# EAGLE design High-Level PCB v3.0 (EAGLE 8.7.0)
TITLE: High-Level PCB
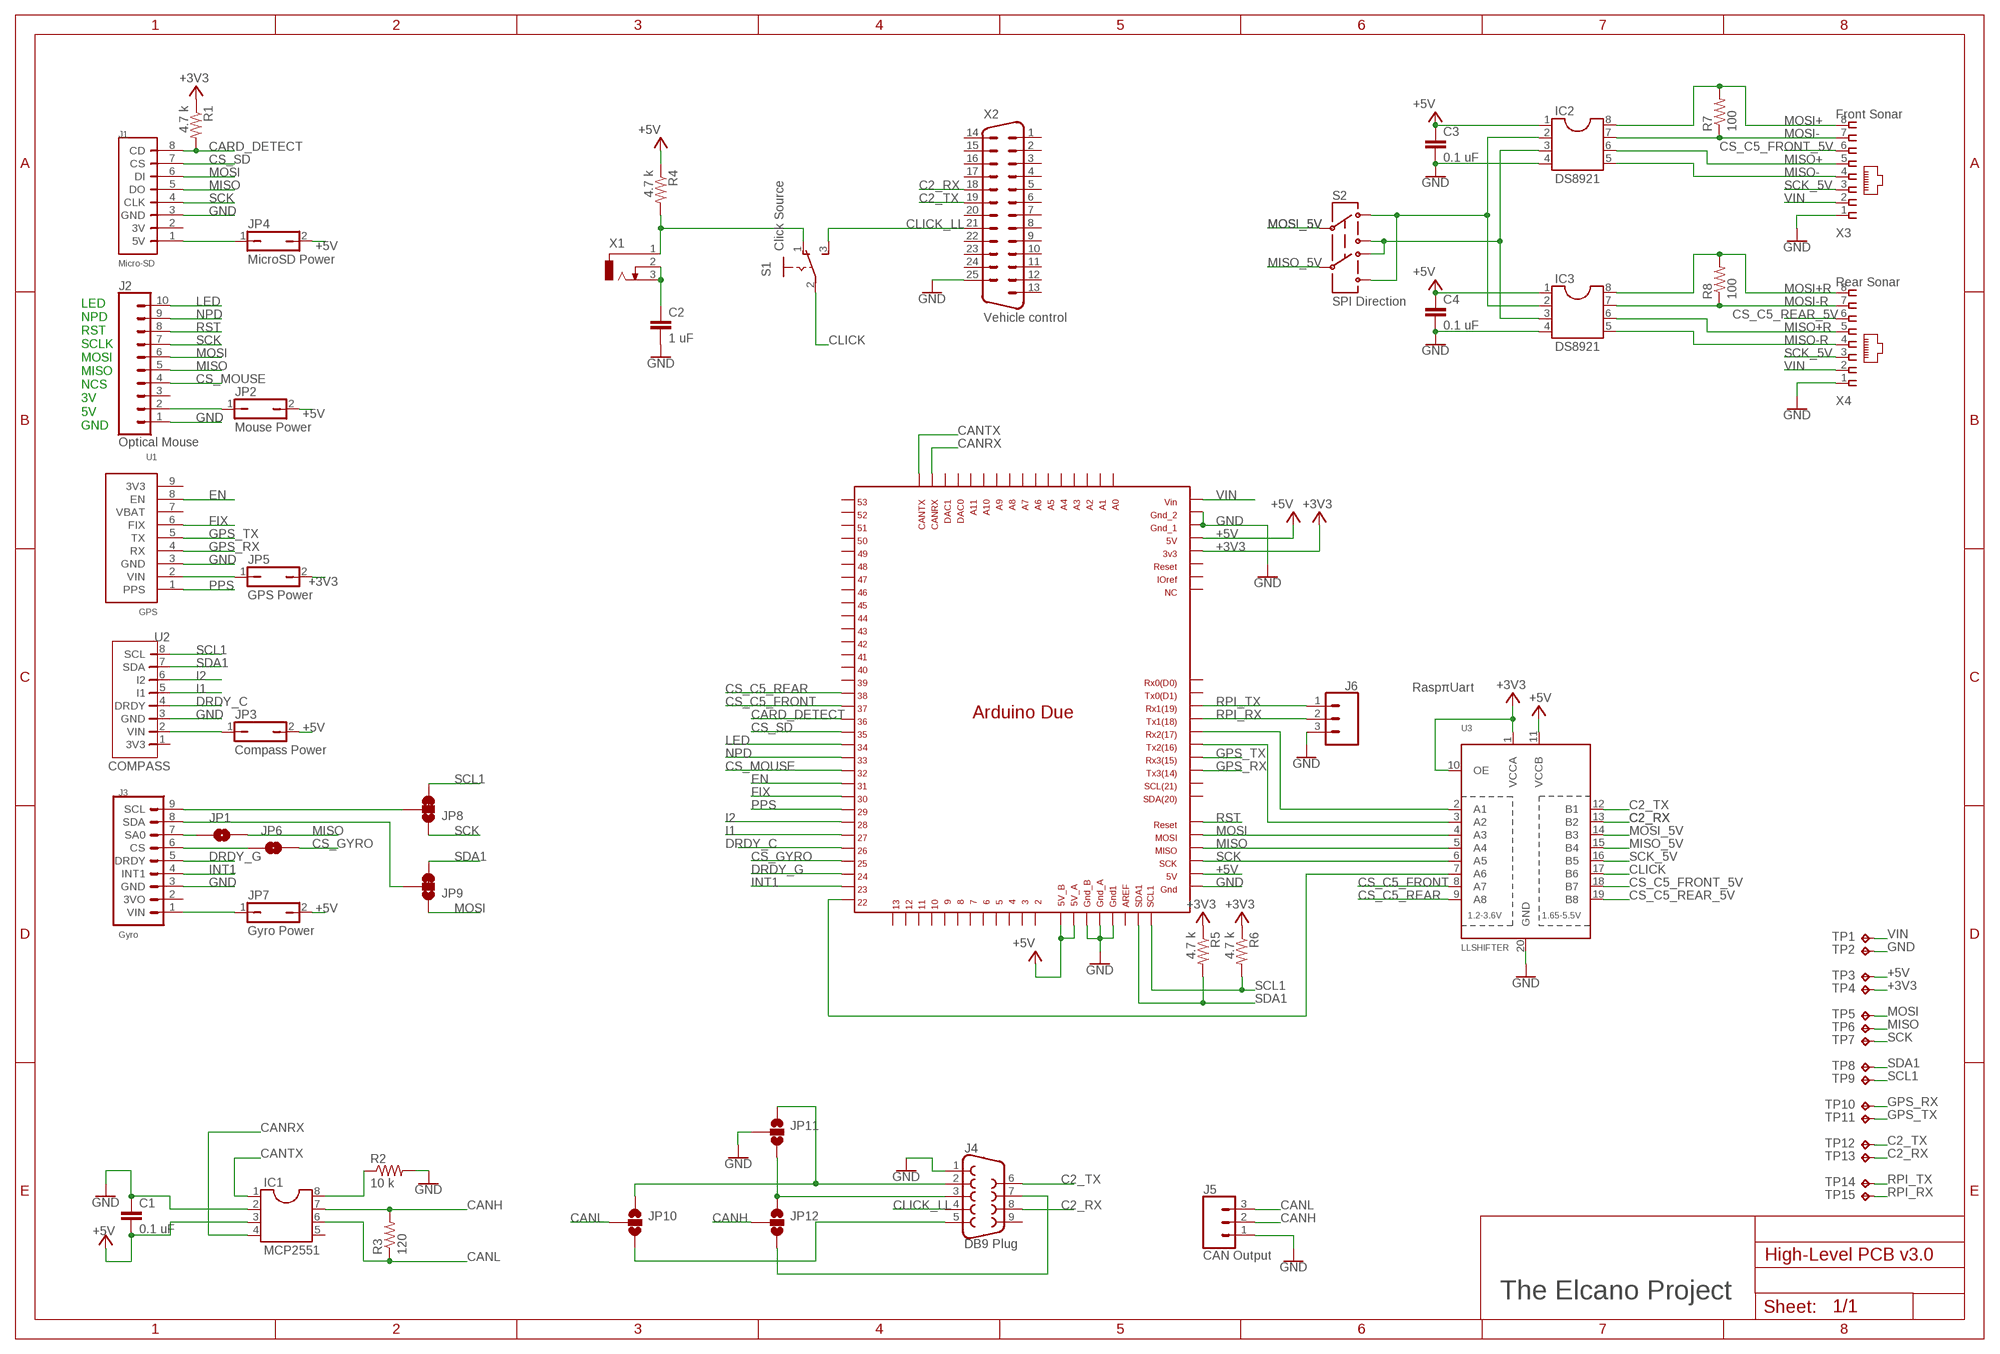
[diagram p0: schematic, sheet 1]

## Parts
C1  0.1 uF  C2.5/5  [C2.5-5]
C2  1 uF  C2.5/5  [C2.5-5]
C3  0.1 uF  C2.5/5  [C2.5-5]
C4  0.1 uF  C2.5/5  [C2.5-5]
IC1  MCP2551  DIL8  [DIL08]
IC2  DS8921  DIL8  [DIL08]
IC3  DS8921  DIL8  [DIL08]
J1  Micro-SD  MINI_SD  [ELSDCARD]
J2  Optical Mouse  CONN_10"  [1X10]
J3  Gyro  ELGYRO_L3GD20H  [ELGYRO]
J4  DB9 Plug  DB9MALE  [DB9_MALE]
J5  CAN Output  CONN_03-SCREW-5MM  [SCREWTERMINAL-5MM-3]
J6  RaspπUart  TXRX_2RSPPI  [1X03]
JP1  JUMPER-SMT_2_NO_SILK  [SMT-JUMPER_2_NO_SILK]
JP2  Mouse Power  JP1Q  [JP1]
JP3  Compass Power  JP1Q  [JP1]
JP4  MicroSD Power  JP1Q  [JP1]
JP5  GPS Power  JP1Q  [JP1]
JP6  JUMPER-SMT_2_NO_SILK  [SMT-JUMPER_2_NO_SILK]
JP7  Gyro Power  JP1Q  [JP1]
JP8  JUMPER-SMT_3_1-NC_TRACE_SILK  [SMT-JUMPER_3_1-NC_TRACE_SILK]
JP9  JUMPER-SMT_3_1-NC_TRACE_SILK  [SMT-JUMPER_3_1-NC_TRACE_SILK]
JP10  JUMPER-SMT_3_NO_SILK  [SMT-JUMPER_3_NO_SILK]
JP11  JUMPER-SMT_3_NO_SILK  [SMT-JUMPER_3_NO_SILK]
JP12  JUMPER-SMT_3_NO_SILK  [SMT-JUMPER_3_NO_SILK]
MCU1  DUE(NORMAL)  [DUE(NORMAL)]
R1  4.7 k  R-US_0204/7  [0204/7]
R2  10 k  R-US_0204/7  [0204/7]
R3  120  R-US_0204/7  [0204/7]
R4  4.7 k  R-US_0204/7  [0204/7]
R5  4.7 k  R-US_0204/7  [0204/7]
R6  4.7 k  R-US_0204/7  [0204/7]
R7  100  R-US_0204/7  [0204/7]
R8  100  R-US_0204/7  [0204/7]
S1  Click Source  ELSWITCHSP  [SP_ELSWITCH]
S2  SPI Direction  DPDT  [DPDT]
TP1  TPPAD1-17  [P1-17]
TP2  TPPAD1-17  [P1-17]
TP3  TPPAD1-17  [P1-17]
TP4  TPPAD1-17  [P1-17]
TP5  TPPAD1-17  [P1-17]
TP6  TPPAD1-17  [P1-17]
TP7  TPPAD1-17  [P1-17]
TP8  TPPAD1-17  [P1-17]
TP9  TPPAD1-17  [P1-17]
TP10  TPPAD1-17  [P1-17]
TP11  TPPAD1-17  [P1-17]
TP12  TPPAD1-17  [P1-17]
TP13  TPPAD1-17  [P1-17]
TP14  TPPAD1-17  [P1-17]
TP15  TPPAD1-17  [P1-17]
U1  GPS  ELGPS  [ELGPS]
U2  COMPASS  ELCOMPASS  [ELCOMPASS]
U3  LLSHIFTER  ELSHIFTER  [ELSHIFTER]
X1  2.5MMJACK  [2.5MMJACK]
X2  Vehicle control  M25H  [M25H]
X3  Front Sonar  RJ45-8L-B  [RJ45-NO-SHIELD]
X4  Rear Sonar  RJ45-8L-B  [RJ45-NO-SHIELD]

## Nets
+3V3 [Power]: JP5.2 MCU1.3V3 R1.1 R5.1 R6.1 TP4.TP U3.1(VCCA) U3.10(OE)
+5V [Power]: C1.2 C3.1 C4.1 IC1.3 IC2.1 IC3.1 JP2.2 JP3.2 JP4.2 JP7.2 MCU1.5V MCU1.5V_A MCU1.5V_B MCU1.GND_ICSP R4.1 TP3.TP U3.11(VCCB)
C2_RX: J4.8 TP13.TP U3.13(B2) X2.18
C2_TX: J4.6 TP12.TP U3.12(B1) X2.19
CANH: IC1.7 J5.2 JP12.2 R3.2
CANL: IC1.6 J5.3 JP10.2 R3.1
CANRX: IC1.4 MCU1.CANRX
CANTX: IC1.1 MCU1.CANTX
CARD_DETECT: J1.8(CD) MCU1.36 R1.2
CLICK: S1.2(P) U3.17(B6)
CLICK_LL: J4.4 S1.3(S) X2.21
CS_C5_FRONT: MCU1.37 U3.8(A7)
CS_C5_FRONT_5V: U3.18(B7) X3.6
CS_C5_REAR: MCU1.38 U3.9(A8)
CS_C5_REAR_5V: U3.19(B8) X4.6
CS_GYRO: JP6.2 MCU1.25
CS_MOUSE: J2.4 MCU1.32
CS_SD: J1.7(CS) MCU1.35
DRDY_C: MCU1.26 U2.4(DRDY)
DRDY_G: J3.5(DRDY) MCU1.24
EN: MCU1.31 U1.8(EN)
FIX: MCU1.30 U1.6(FIX)
GND: C1.1 C2.2 C3.2 C4.2 IC1.2 IC2.4 IC3.4 J1.3(GND) J2.1 J3.3(GND) J4.1 J5.1 J6.3 JP11.2 MCU1.5V_ICSP MCU1.GND1 MCU1.GND_1 MCU1.GND_2 MCU1.GND_A MCU1.GND_B R2.2 TP2.TP U1.3(GND) U2.3(GND) U3.20(GND) X2.25 X3.1 X4.1
GPS_RX: MCU1.TX3 TP10.TP U1.4(RX)
GPS_TX: MCU1.RX3 TP11.TP U1.5(TX)
I1: MCU1.27 U2.5(I1)
I2: MCU1.28 U2.6(I2)
INT1: J3.4(INT1) MCU1.23
LED: J2.10 MCU1.34
MISO: J1.5(DO) J2.5 JP1.2 MCU1.MISO_ICSP TP6.TP U3.5(A4)
MISO+: IC2.6 X3.5
MISO+R: IC3.6 X4.5
MISO-: IC2.5 X3.4
MISO-R: IC3.5 X4.4
MISO_5V: S2.5 U3.15(B4)
MOSI: J1.6(DI) J2.6 JP9.1 MCU1.MOSI_ICSP TP5.TP U3.4(A3)
MOSI+: IC2.8 R7.2 X3.8
MOSI+R: IC3.8 R8.2 X4.8
MOSI-: IC2.7 R7.1 X3.7
MOSI-R: IC3.7 R8.1 X4.7
MOSI_5V: S2.2 U3.14(B3)
N$1: C2.1 X1.2 X1.3
N$2: IC2.2 IC3.2 S2.1 S2.6
N$3: IC2.3 IC3.3 S2.3 S2.4
N$4: MCU1.TX2 U3.3(A2)
N$5: MCU1.RX2 U3.2(A1)
N$7: R4.2 S1.1(O) X1.1
N$8 [Power]: JP3.1 U2.2(VIN)
N$9 [Power]: J3.1(VIN) JP7.1
N$10 [Power]: J1.1(5V) JP4.1
N$11: J4.3 JP11.3 JP12.1
N$12: MCU1.22 U3.7(A6)
N$13 [Power]: J2.2 JP2.1
N$14 [Power]: JP5.1 U1.2(VIN)
N$15: J4.5 JP10.3
N$16: J4.7 JP12.3
N$17: IC1.8 R2.1
N$18: J4.2 JP10.1 JP11.1
N$19: J3.6(CS) JP6.1
N$20: J3.7(SA0) JP1.1
N$21: J3.8(SDA) JP9.2
N$22: J3.9(SCL) JP8.2
NPD: J2.9 MCU1.33
PPS: MCU1.29 U1.1(PPS)
RPI_RX: J6.2 MCU1.TX1 TP15.TP
RPI_TX: J6.1 MCU1.RX1 TP14.TP
RST: J2.8 MCU1.RESET_ICSP
SCK: J1.4(CLK) J2.7 JP8.1 MCU1.SCK_ICSP TP7.TP U3.6(A5)
SCK_5V: U3.16(B5) X3.3 X4.3
SCL1: JP8.3 MCU1.SCL1 R6.2 TP9.TP U2.8(SCL)
SDA1: JP9.3 MCU1.SDA1 R5.2 TP8.TP U2.7(SDA)
VIN [Power]: MCU1.VIN TP1.TP X3.2 X4.2
Unconnected: IC1.5 J1.2(3V) J2.3 J3.2(3VO) J4.9 MCU1.2 MCU1.3 MCU1.4 MCU1.5 MCU1.6 MCU1.7 MCU1.8 MCU1.9 MCU1.10 MCU1.11 MCU1.12 MCU1.13 MCU1.39 MCU1.40 MCU1.41 MCU1.42 MCU1.43 MCU1.44 MCU1.45 MCU1.46 MCU1.47 MCU1.48 MCU1.49 MCU1.50 MCU1.51 MCU1.52 MCU1.53 MCU1.A0 MCU1.A1 MCU1.A2 MCU1.A3 MCU1.A4 MCU1.A5 MCU1.A6 MCU1.A7 MCU1.A8 MCU1.A9 MCU1.A10 MCU1.A11 MCU1.AREF MCU1.DAC0 MCU1.DAC1 MCU1.IOREF MCU1.NC MCU1.RESET MCU1.RX0 MCU1.SCL MCU1.SDA MCU1.TX0 U1.7(VBAT) U1.9(3V3) U2.1(3V3) X2.1 X2.2 X2.3 X2.4 X2.5 X2.6 X2.7 X2.8 X2.9 X2.10 X2.11 X2.12 X2.13 X2.14 X2.15 X2.16 X2.17 X2.20 X2.22 X2.23 X2.24

## Notes on the sheet
- LED
  NPD
  RST
  SCLK
  MOSI
  MISO
  NCS
  3V
  5V
  GND
- The Elcano Project

## Library data of the parts
C1-C4 = capacitor-wima:C: CAPACITOR naming: grid - package width
IC1-IC3 = ic-package:DIL8: Dual In Line / Socket
J1 = ELCano_Footprints:MINI_SD: SD Breakoutboard footprint for ELCano Project https://learn.adafruit.com/adafruit-micro-sd-breakout-board-card-tutorial/introduction
J2 = SparkFun-Connectors:CONN_10: Multi connection point. Often used as Generic Header-pin footprint for 0.1 inch spaced/style header connections On any of the 0.1 inch spaced packages, you can populate with these: Break Away Headers - Straight <https://www.sparkfun.com/products/116> (PRT-00116) Break Away Male Headers - Right Angle <https://www.sparkfun.com/products/553> (PRT-00553) Female Headers <https://www.sparkfun.com/products/115> (PRT-00115) Break Away Headers - Machine Pin <https://www.sparkfun.com/products/117> (PRT-00117) Break Away Female Headers - Swiss Machine Pin <https://www.sparkfun.com/products/743> (PRT-00743) Arduino Stackable Header - 10 Pin <https://www.sparkfun.com/products/11376> (PRT-11376) For SCREWTERMINALS and SPRING TERMINALS visit here: Screw Terimnals on SparkFun.com <https://www.sparkfun.com/search/results?term=Screw+Terminals> (5mm/3.5mm/2.54mm spacing) This device is also useful as a general connection point to wire up your design to another part of your project. Our various solder wires solder well into these plated through hole pads. Hook-Up Wire - Assortment (Stranded, 22 AWG) <https://www.sparkfun.com/products/11375> (PRT-11375) Hook-Up Wire - Assortment (Solid Core, 22 AWG) <https://www.sparkfun.com/products/11367> (PRT-11367) View the entire wire category on our website here <https://www.sparkfun.com/categories/141> Special notes: Molex polarized connector foot print use with SKU : PRT-08231 with associated crimp pins and housings. 1MM SMD Version SKU: PRT-10208 NOTES ON THE VARIANTS LOCK and LOCK_LONGPADS... This footprint was designed to help hold the alignment of a through-hole component (i.e. 6-pin header) while soldering it into place. You may notice that each hole has been shifted either up or down by 0.005 of an inch from it's more standard position (which is a perfectly straight line). This slight alteration caused the pins (the squares in the middle) to touch the edges of the holes. Because they are alternating, it causes a "brace" to hold the component in place. 0.005 has proven to be the perfect amount of "off-center" position when using our standard breakaway headers. Although looks a little odd when you look at the bare footprint, once you have a header in there, the alteration is very hard to notice. Also,if you push a header all the way into place, it is covered up entirely on the bottom side.; PROD_ID: CONN-11563
J3 = ELCano_Footprints:ELGYRO_L3GD20H
J4 = SparkFun-Connectors:DB9: DB9 Connector Standard DB9 (D-Sub 9) serial connector. Can be used for CAN bus as well as RS485 and RS232. Footprint production proven. Here is the female version connector we sell at SparkFun: 9 Pin Female Serial Connector - PCB Mount <https://www.sparkfun.com/products/429> (PRT-00429) This connector has been used on the following SparkFun products: SparkFun RS232 Shifter - SMD <https://www.sparkfun.com/products/449> (PRT-00449) SparkFun RS232 Shifter SMD (No DB9) <https://www.sparkfun.com/products/8780> (PRT-08780); PROD_ID: CONN-09904; SPICEPREFIX: X
J5 = SparkFun-Connectors:CONN_03: Multi connection point. Often used as Generic Header-pin footprint for 0.1 inch spaced/style header connections On any of the 0.1 inch spaced packages, you can populate with these: Break Away Headers - Straight <https://www.sparkfun.com/products/116> (PRT-00116) Break Away Male Headers - Right Angle <https://www.sparkfun.com/products/553> (PRT-00553) Female Headers <https://www.sparkfun.com/products/115> (PRT-00115) Break Away Headers - Machine Pin <https://www.sparkfun.com/products/117> (PRT-00117) Break Away Female Headers - Swiss Machine Pin <https://www.sparkfun.com/products/743> (PRT-00743) Stackable Header - 3 Pin (Female, 0.1") <https://www.sparkfun.com/products/13875> (PRT-13875) For SCREWTERMINALS and SPRING TERMINALS visit here: Screw Terimnals on SparkFun.com <https://www.sparkfun.com/search/results?term=Screw+Terminals> (5mm/3.5mm/2.54mm spacing) This device is also useful as a general connection point to wire up your design to another part of your project. Our various solder wires solder well into these plated through hole pads. Hook-Up Wire - Assortment (Stranded, 22 AWG) <https://www.sparkfun.com/products/11375> (PRT-11375) Hook-Up Wire - Assortment (Solid Core, 22 AWG) <https://www.sparkfun.com/products/11367> (PRT-11367) View the entire wire category on our website here <https://www.sparkfun.com/categories/141> Special notes: Molex polarized connector foot print use with SKU : PRT-08232 with associated crimp pins and housings.; PROD_ID: CONN-10134; SF_SKU: PRT-08433
J6 = ELCano_Footprints:TXRX_2RSPPI: Multi connection point. Often used as Generic Header-pin footprint for 0.1 inch spaced/style header connections On any of the 0.1 inch spaced packages, you can populate with these: Break Away Headers - Straight <https://www.sparkfun.com/products/116> (PRT-00116) Break Away Male Headers - Right Angle <https://www.sparkfun.com/products/553> (PRT-00553) Female Headers <https://www.sparkfun.com/products/115> (PRT-00115) Break Away Headers - Machine Pin <https://www.sparkfun.com/products/117> (PRT-00117) Break Away Female Headers - Swiss Machine Pin <https://www.sparkfun.com/products/743> (PRT-00743) For SCREWTERMINALS and SPRING TERMINALS visit here: Screw Terimnals on SparkFun.com <https://www.sparkfun.com/search/results?term=Screw+Terminals> (5mm/3.5mm/2.54mm spacing) This device is also useful as a general connection point to wire up your design to another part of your project. Our various solder wires solder well into these plated through hole pads. Hook-Up Wire - Assortment (Stranded, 22 AWG) <https://www.sparkfun.com/products/11375> (PRT-11375) Hook-Up Wire - Assortment (Solid Core, 22 AWG) <https://www.sparkfun.com/products/11367> (PRT-11367) View the entire wire category on our website here <https://www.sparkfun.com/categories/141> Special notes: Molex polarized connector foot print use with: PRT-08233 with associated crimp pins and housings. 2.54_SCREWTERM for use with PRT-10571. 3.5mm Screw Terminal footprints for PRT-08084 5mm Screw Terminal footprints for use with PRT-08432
JP1 JP6 = SparkFun-Jumpers:JUMPER-SMT_2_NO: Normally open jumper This jumper has two pads in close proximity to each other. Apply solder to close the connection. Round pads are easier to solder for beginners, but are a lot larger. SparkFun Product that uses the round pads: SparkFun EL Sequencer <https://www.sparkfun.com/products/12781>
JP2-JP5 JP7 = jumper:JP1Q: JUMPER
JP8 JP9 = SparkFun-Jumpers:JUMPER-SMT_3_1-NC_TRACE: Normally closed trace jumper (1 of 2 connections) This jumper has a trace between two pads so it's normally closed (NC). The other connection is normally open (NO). Use a razor knife to open the connection. For best results follow the IPC guidelines for cutting traces: Cutout at least 0.063 mm (0.005 in). Remove all loose material to clean up the cut area. Seal the cut with an approved epoxy. Reapply solder to reclose the connection, or to close the NO connection.
JP10-JP12 = SparkFun-Jumpers:JUMPER-SMT_3_NO: Normally open jumper This jumper has three pads in close proximity to each other. Apply solder to close the connection(s).
MCU1 = DUElib130425:DUE(NORMAL)
R1 R4-R6 = resistor:R-US_: RESISTOR, American symbol
R2 R3 R7 R8 = rcl:R-US_: RESISTOR, American symbol; SPICEPREFIX: R
S1 = ELCano_Footprints:ELSWITCHSP: SLIDING SWITCH Distributor Buerklin, 11G810
S2 = ELCano_Footprints:DPDT
TP1-TP15 = testpad:TP: Test pad
U1 = ELCano_Footprints:ELGPS: FootPrint for Adafruit Ultimate GPS.
U2 = ELCano_Footprints:ELCOMPASS: ADAFRUIT LSM303DLHC COMPASS FOOT PRINT
U3 = ELCano_Footprints:ELSHIFTER: TXB0108 LEVEL SHIFTER. Foot Print for adafruit breakout board.
X1 = ELCano_Footprints:2.5MMJACK: New jack for Elcano
X2 = con-subd:M25: SUB-D; OC_FARNELL: unknown; OC_NEWARK: unknown
X3 X4 = con-tycoelectronics:RJ45: CORCOM Modular RJ Jacks No Shield Source: www.tycoelectronics.com .. ENG_DS_1654001_1099_RJ_L_0507.pdf; MF: TYCO ELECTRONICS; MPN: RJ45-8L-B; OC_FARNELL: 1279843; OC_NEWARK: 52K4445

## Net classes
1 Power: width 0.254 mm, drill 0.305 mm, clearance 0.254 mm

## Board
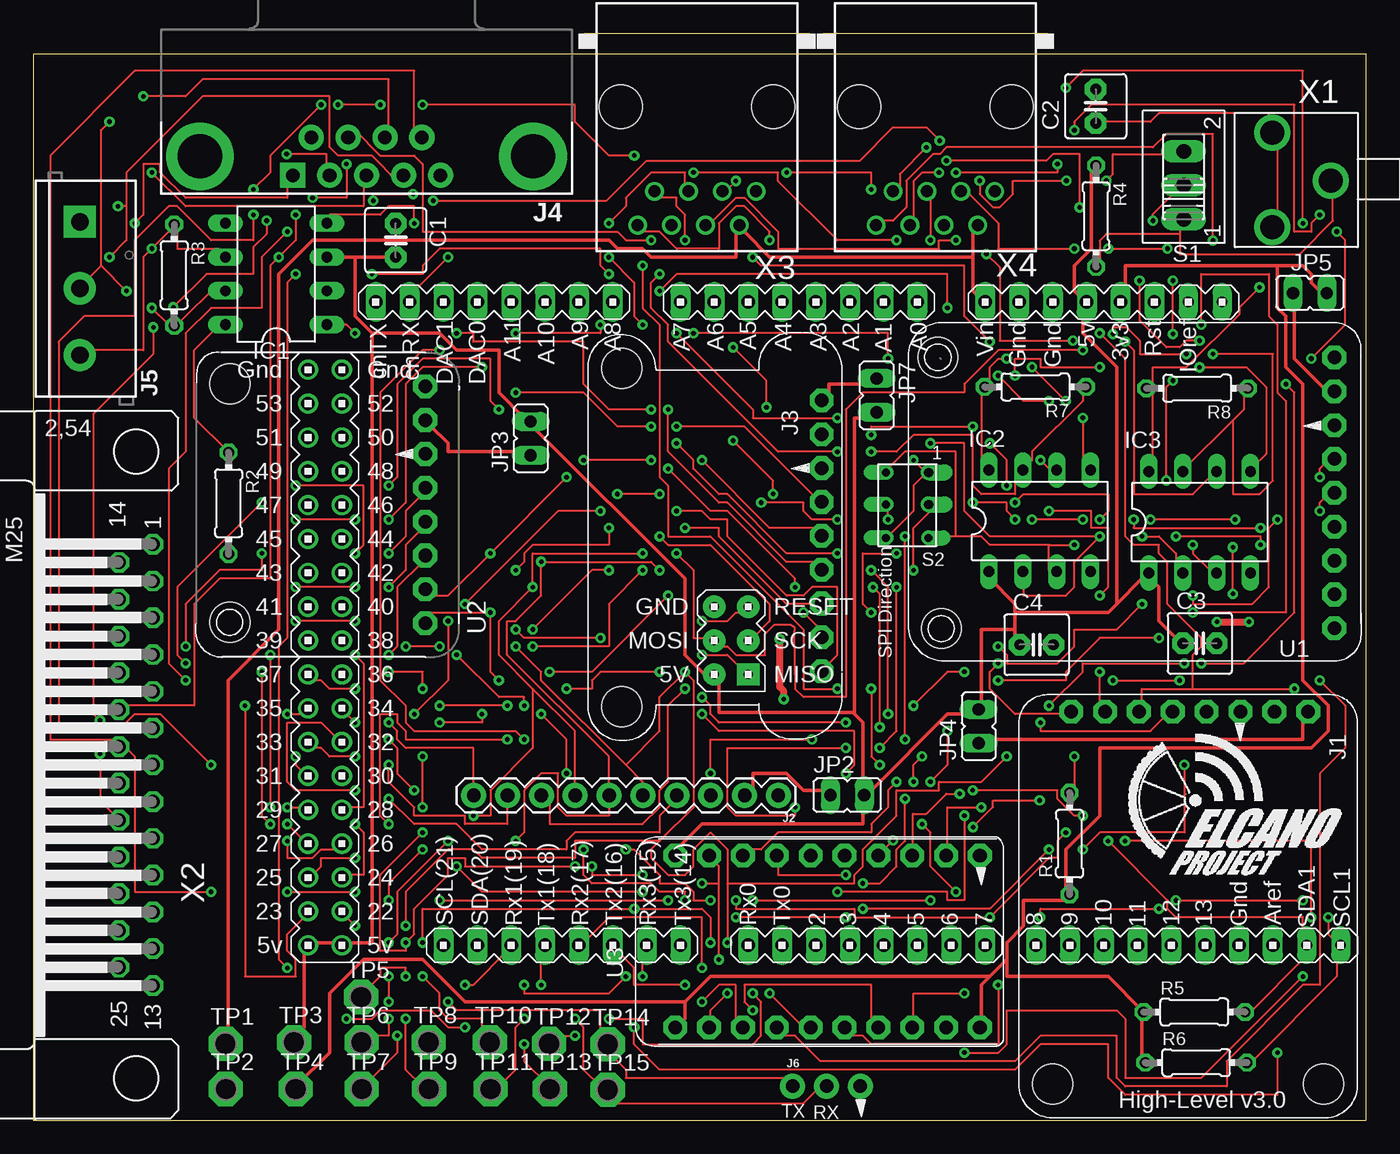
[diagram p1: board, top side]
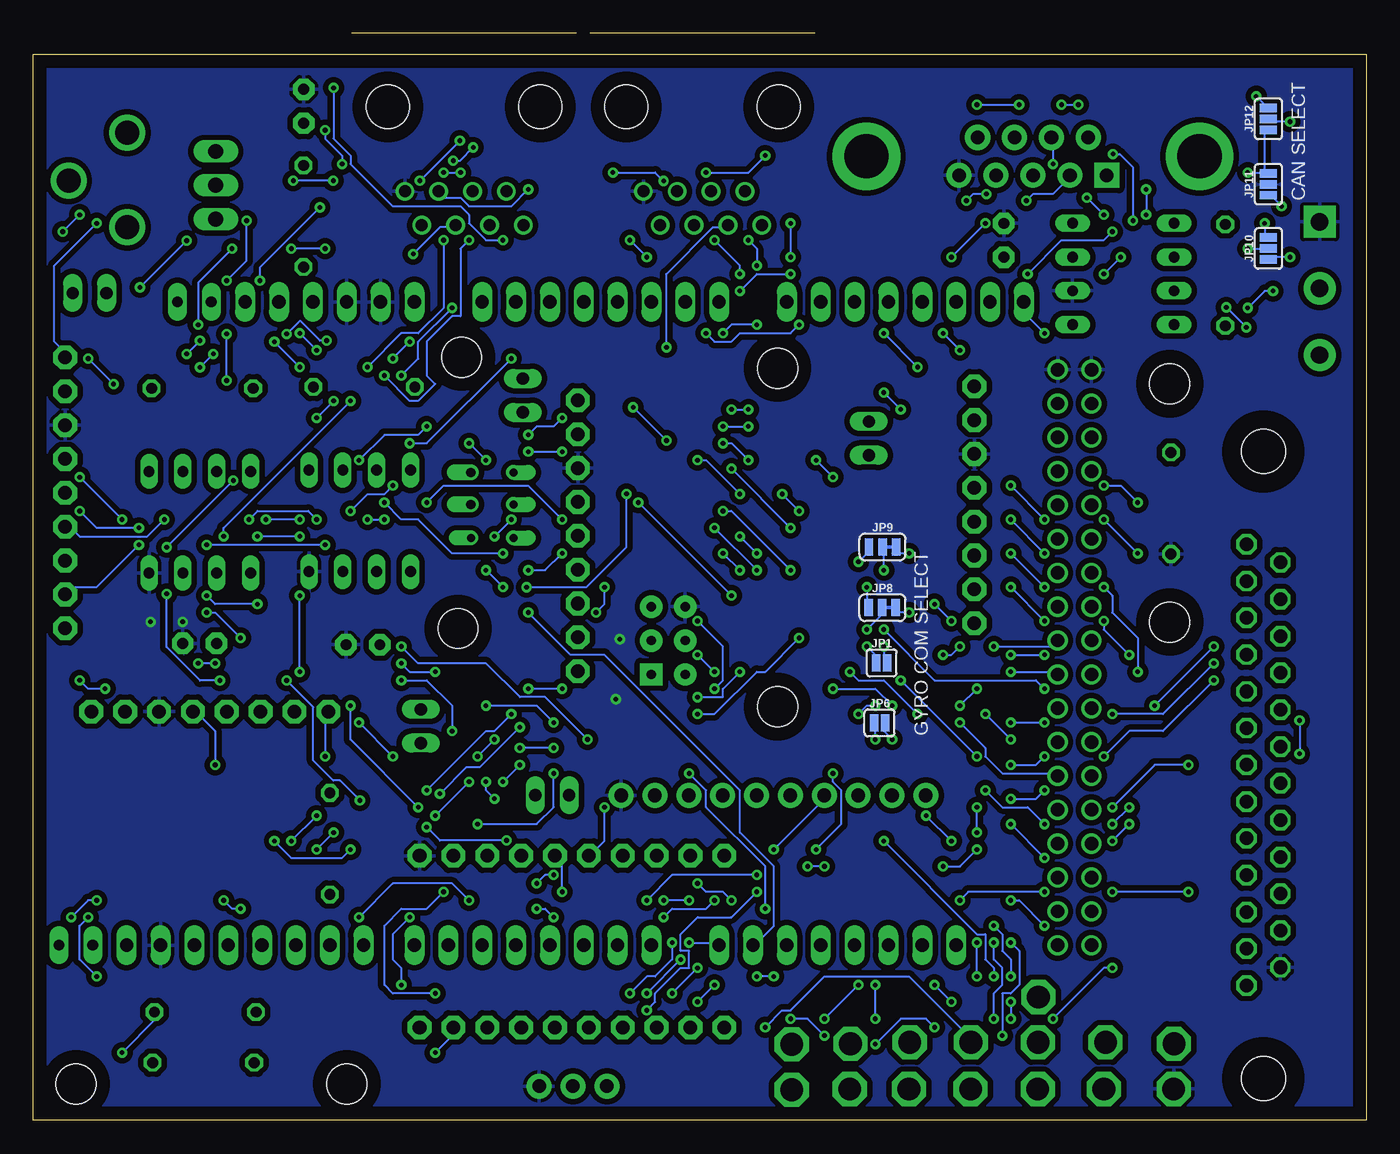
[diagram p2: board, bottom side, seen from below]

Size 100 x 80 mm. Coordinates in mm from the lower left corner, seen from the top.
Outline: 0,0 100,0 100,80 0,80 0,0
Copper layers (1*16): Top 0.035mm / dielectric 1.5mm / Bottom 0.035mm
Design rules "default": minimum track width 6mil, minimum drill 0.35mm, track to track 6mil, track to pad 6mil, pad to pad 6mil, via to via 6mil, smd to smd 6mil, copper to edge 40mil, drill to drill 6mil, minimum pad ring 10mil, minimum via ring 8mil, stop-mask expansion 4mil, vias tented up to drill 0mil, thermal gap 10mil

### Footprints (pad centres in the part's own frame; a part is rotated, then mirrored left to right if it is on the bottom)
C2.5-5 = drill 0.813 pad 1.6 octagon: 1 -1.27,0; 2 1.27,0
DIL08 = drill 0.813 long: 1 -3.81,-3.81; 2 -1.27,-3.81; 3 1.27,-3.81; 4 3.81,-3.81; 5 3.81,3.81; 6 1.27,3.81; 7 -1.27,3.81; 8 -3.81,3.81
ELSDCARD = drill 1.016 pad 1.778 octagon: 1 30.47,-9.03; 2 30.47,-6.49; 3 30.47,-3.95; 4 30.47,-1.41; 5 30.47,1.13; 6 30.47,3.67; 7 30.47,6.21; 8 30.47,8.75 | hole 3: 2.53,-10.173; 2.53,10.147
1X10 = drill 1.016 pad 1.88: 1 0,0; 2 2.54,0; 3 5.08,0; 4 7.62,0; 5 10.16,0; 6 12.7,0; 7 15.24,0; 8 17.78,0; 9 20.32,0; 10 22.86,0
ELGYRO = drill 1.016 pad 1.778 octagon: 1 22.901,-7.437; 2 20.361,-7.437; 3 17.821,-7.437; 4 15.281,-7.437; 5 12.741,-7.437; 6 10.201,-7.437; 7 7.661,-7.437; 8 5.121,-7.437; 9 2.581,-7.437 | hole 3: -0.086,7.549; 25.314,7.549
DB9_MALE = drill 1.016 pad 1.88: 1 5.54,-1.42; 2 2.77,-1.42; 3 0,-1.42; 4 -2.77,-1.42; 6 4.15,1.42; 7 1.38,1.42; 8 -1.38,1.42; 9 -4.15,1.42 | drill 1.016 pad 1.88 square: 5 -5.54,-1.42 | drill 3.302 pad 5.08: G1 -12.5,0; G2 12.5,0
SCREWTERMINAL-5MM-3 = drill 1.3 pad 2.413 square: 1 0,0 | drill 1.3 pad 2.413: 2 5,0; 3 10,0
1X03 = drill 1.016 pad 1.88: 1 2.54,0; 2 0,0; 3 -2.54,0
SMT-JUMPER_2_NO_SILK = smd 0.635 x 1.27: 1 -0.406,0; 2 0.406,0
JP1 = drill 0.914 long: 1 0,-1.27; 2 0,1.27
SMT-JUMPER_3_1-NC_TRACE_SILK = smd 0.635 x 1.27: 1 -1.016,0; 2 0,0; 3 1.016,0
SMT-JUMPER_3_NO_SILK = smd 0.635 x 1.27: 1 -0.813,0; 2 0,0; 3 0.813,0
DUE(NORMAL) = drill 1 long: 2 -16.51,30.48; 3 -19.05,30.48; 3V3 -39.37,-17.78; 4 -21.59,30.48; 5 -24.13,30.48; 5V -36.83,-17.78; 6 -26.67,30.48; 7 -29.21,30.48; 8 -33.02,30.48; 9 -35.56,30.48; 10 -38.1,30.48; 11 -40.64,30.48; 12 -43.18,30.48; 13 -45.72,30.48; A0 -24.13,-17.78; A1 -21.59,-17.78; A2 -19.05,-17.78; A3 -16.51,-17.78; A4 -13.97,-17.78; A5 -11.43,-17.78; A6 -8.89,-17.78; A7 -6.35,-17.78; A8 -1.27,-17.78; A9 1.27,-17.78; A10 3.81,-17.78; A11 6.35,-17.78; AREF -50.8,30.48; CANRX 13.97,-17.78; CANTX 16.51,-17.78; DAC0 8.89,-17.78; DAC1 11.43,-17.78; GND1 -48.26,30.48; GND_1 -34.29,-17.78; GND_2 -31.75,-17.78; RESET -41.91,-17.78; RX0 -11.43,30.48; RX1 6.35,30.48; RX2 1.27,30.48; RX3 -3.81,30.48; SCL 11.43,30.48; SDA 8.89,30.48; TX0 -13.97,30.48; TX1 3.81,30.48; TX2 -1.27,30.48; TX3 -6.35,30.48; VIN -29.21,-17.78 | drill 1: 5V_A 19.05,30.48; 5V_B 21.59,30.48; 22 19.05,27.94; 23 21.59,27.94; 24 19.05,25.4; 25 21.59,25.4; 26 19.05,22.86; 27 21.59,22.86; 28 19.05,20.32; 29 21.59,20.32; 30 19.05,17.78; 31 21.59,17.78; 32 19.05,15.24; 33 21.59,15.24; 34 19.05,12.7; 35 21.59,12.7; 36 19.05,10.16; 37 21.59,10.16; 38 19.05,7.62; 39 21.59,7.62; 40 19.05,5.08; 41 21.59,5.08; 42 19.05,2.54; 43 21.59,2.54; 44 19.05,0; 45 21.59,0; 46 19.05,-2.54; 47 21.59,-2.54; 48 19.05,-5.08; 49 21.59,-5.08; 50 19.05,-7.62; 51 21.59,-7.62; 52 19.05,-10.16; 53 21.59,-10.16; GND_A 19.05,-12.7; GND_B 21.59,-12.7 | drill 0.7 pad 1.676: 5V_ICSP -8.89,5.08; GND_ICSP -8.89,10.16; MOSI_ICSP -8.89,7.62; RESET_ICSP -11.43,5.08; SCK_ICSP -11.43,7.62 | drill 0.8 pad 1.422 long: IOREF -44.45,-17.78; NC -46.99,-17.78; SCL1 -55.88,30.48; SDA1 -53.34,30.48 | drill 0.7 pad 1.676 square: MISO_ICSP -11.43,10.16
0204/7 = drill 0.813 octagon: 1 -3.81,0; 2 3.81,0
SP_ELSWITCH = drill 1.118 long: 1 -3.81,0; 2 -1.27,0; 3 1.27,0
DPDT = drill 0.6 offset: 1 3.2,4.9; 2 3.2,2.4; 3 3.2,0; 4 0,4.9 | drill 0.7 offset: 5 0,2.4; 6 0,0
P1-17 = drill 1.702 pad 2.54 octagon: TP 0,0
ELGPS = drill 1.016 pad 1.778 octagon: 1 0,-10.16; 2 0,-7.62; 3 0,-5.08; 4 0,-2.54; 5 0,0; 6 0,2.54; 7 0,5.08; 8 0,7.62; 9 0,10.16 | hole 3: 29.48,10.18; 29.74,-10.18
ELCOMPASS = drill 1.016 pad 1.778 octagon: 1 1.27,1.27; 2 1.27,3.81; 3 1.27,6.35; 4 1.27,8.89; 5 1.27,11.43; 6 1.27,13.97; 7 1.27,16.51; 8 1.27,19.05 | hole 3: 15.926,18.97; 15.926,1.09
ELSHIFTER = drill 1.016 pad 1.778 octagon: 1 -5.2,24.63; 2 -5.2,22.09; 3 -5.2,19.55; 4 -5.2,17.01; 5 -5.2,14.47; 6 -5.2,11.93; 7 -5.2,9.39; 8 -5.2,6.85; 9 -5.2,4.31; 10 -5.2,1.77; 11 7.69,24.63; 12 7.69,22.09; 13 7.69,19.55; 14 7.69,17.01; 15 7.69,14.47; 16 7.69,11.93; 17 7.69,9.39; 18 7.69,6.85; 19 7.69,4.31; 20 7.69,1.77
2.5MMJACK = drill 1.8: 1 2,5.1; 2 6.4,1.5; 3 6.4,8.6
M25H = drill 1.016 octagon: 1 -16.561,1.27; 2 -13.792,1.27; 3 -11.049,1.27; 4 -8.28,1.27; 5 -5.512,1.27; 6 -2.769,1.27; 7 0,1.27; 8 2.769,1.27; 9 5.512,1.27; 10 8.28,1.27; 11 11.049,1.27; 12 13.792,1.27; 13 16.561,1.27; 14 -15.189,-1.27; 15 -12.421,-1.27; 16 -9.652,-1.27; 17 -6.909,-1.27; 18 -4.14,-1.27; 19 -1.372,-1.27; 20 1.372,-1.27; 21 4.14,-1.27; 22 6.909,-1.27; 23 9.652,-1.27; 24 12.421,-1.27; 25 15.189,-1.27 | hole 3.302: 23.52,0; -23.52,0
RJ45-NO-SHIELD = drill 0.9 pad 1.4: 1 -4.445,6.35; 2 -3.175,8.89; 3 -1.905,6.35; 4 -0.635,8.89; 5 0.635,6.35; 6 1.905,8.89; 7 3.175,6.35; 8 4.445,8.89 | hole 3.251: -5.715,0; 5.715,0

### Placement (x,y rotation side)
C1  27.19,66.03 270 top
C2  79.71,76.09 90 top
C3  87.52,35.79 0 top
C4  75.27,35.69 0 top
IC1  18.22,63.51 90 top
IC2  75.51,44.98 0 top
IC3  87.51,44.88 0 top
J1  86.62,0.2 90 top
J2  55.9,24.38 180 top
J3  51.71,31.12 90 top
J4  25,72.33 0 top
J5  3.49,67.42 270 top
J6  59.51,2.56 180 top
JP1  36.35,34.33 0 bottom
JP2  61.07,24.4 270 top
JP3  37.31,51.17 0 top
JP4  70.92,29.57 0 top
JP5  95.78,62.07 270 top
JP6  36.51,29.83 0 bottom
JP7  63.28,54.39 180 top
JP8  36.3,38.47 0 bottom
JP9  36.29,43.03 0 bottom
JP10  7.33,65.42 90 bottom
JP11  7.33,70.23 90 bottom
JP12  7.33,75.14 90 bottom
MCU1  42.2,43.62 180 top
R1  77.75,20.76 90 top
R2  14.65,46.3 270 top
R3  10.57,63.42 270 top
R4  79.73,67.84 270 top
R5  87.1,8.13 0 top
R6  87.24,4.33 0 top
R7  75.18,55.03 180 top
R8  87.32,54.93 180 top
S1  86.31,71.43 90 top
S2  67.17,48.61 180 top
TP1  14.42,5.75 0 top
TP2  14.44,2.35 0 top
TP3  19.56,5.85 0 top
TP4  19.68,2.35 0 top
TP5  24.6,9.25 0 top
TP6  24.62,5.85 0 top
TP7  24.64,2.35 0 top
TP8  29.66,5.85 0 top
TP9  29.68,2.35 0 top
TP10  34.25,5.85 0 top
TP11  34.3,2.35 0 top
TP12  38.7,5.75 0 top
TP13  38.75,2.35 0 top
TP14  43.1,5.7 0 top
TP15  43.1,2.3 0 top
U1  97.61,47.08 180 top
U2  30.67,56.35 180 top
U3  72.79,12.17 90 top
X1  99.36,75.6 180 top
X2  7.71,26.67 270 top
X3  49.79,76.05 180 top
X4  67.68,76.05 180 top

### Tracks (layer width: path | path; a pad name or v marks a point on that pad's centre or on a via)
+3V3
  Top 0.254: 93.34,64.14 81.92,64.14 81.92,61.59 MCU1.3V3 | 93.34,64.14 95.25,64.14 95.89,63.5 95.89,62.87 96.52,62.23 JP5.2 | R6.1 83.19,4.45 83.19,7.62 R5.1 83.19,8.26 80.64,10.79 73.03,10.79 73.03,12.06 | 73.03,12.06 73.03,13.34 74.3,14.61 74.3,16.51 77.47,16.51 R1.1 77.47,17.14 77.47,20.32 80.01,22.86 80.01,27.94 95.89,27.94 97.16,29.21 97.16,31.11 95.25,33.02 95.25,55.24 93.98,56.52 93.98,60.33 93.34,60.96 93.34,64.14 | 71.75,10.79 71.12,10.16 71.12,6.99 U3.10 | 71.75,10.79 73.03,12.06 | 48.9,8.89 48.9,7.62 48.26,6.99 U3.1 | 48.9,8.89 50.8,10.79 71.75,10.79 | 48.9,8.89 32.38,8.89 29.21,12.06 24.77,12.06 22.23,9.53 22.23,5.08 19.68,2.54 TP4.TP
+5V
  Top 0.254: R4.1 79.38,71.12 79.38,65.41 78.11,64.14 78.11,62.23 78.74,61.59 MCU1.5V 78.74,60.96 78.74,59.05 81.28,56.52 81.28,38.73 | C3.1 85.72,36.2 84.45,37.47 84.45,40.01 83.82,40.64 IC3.1 83.19,40.64 81.28,38.73 | 73.66,36.83 73.66,36.2 C4.1 | 73.66,36.83 73.66,38.1 | 73.66,38.1 73.66,38.73 71.75,40.64 IC2.1 | JP2.2 62.87,24.77 68.58,30.48 70.48,30.48 JP4.2 71.12,31.11 71.12,36.83 73.66,36.83 | 61.59,30.61 61.59,30.48 62.23,29.84 62.23,24.77 JP2.2 | 61.59,30.61 61.59,52.7 62.87,52.7 JP7.2 | U3.11 48.26,20.32 50.16,22.23 62.23,22.23 62.23,24.13 JP2.2 | 81.28,38.73 80.64,38.1 73.66,38.1 | TP3.TP 19.68,6.35 20.32,6.99 20.32,12.7 MCU1.5V_B 20.95,13.34 22.86,13.34 MCU1.5V_A 23.5,13.34 25.4,13.34 25.4,59.05 | 24.13,64.77 26.67,64.77 C1.2 | 24.13,64.77 22.23,64.77 IC1.3 | 24.13,64.77 24.13,60.33 25.4,59.05 | 25.4,59.05 30.48,59.05 31.75,57.78 34.92,57.78 34.92,54.61 36.83,52.7 JP3.2 37.47,52.07 48.9,40.64 48.9,34.92 50.8,33.02 MCU1.GND_ICSP 51.44,33.02 51.44,30.61 61.59,30.61
C2_RX  (via drill 0.35)
  Top 0.152: v19.68,67.94 19.68,66.04 v18.41,64.77 17.78,64.14 17.78,40.64 13.97,40.64 12.06,38.73 12.06,31.11 6.99,31.11 X2.18 | v20.95,69.22 23.5,69.22 v23.5,71.75 | v64.77,25.4 64.14,24.77 64.14,23.5 62.87,22.23 62.87,21.59 55.88,21.59 54.61,20.32 53.34,20.32 U3.13 | v63.5,26.67 62.87,27.3 v62.87,32.38 | v60.33,32.38 57.78,32.38 57.78,36.83 50.8,43.81 47.62,43.81 47.62,47.62 46.99,48.26 46.99,59.69 45.72,60.96 v45.72,64.14 | v46.35,66.04 44.45,66.04 43.81,66.67 29.21,66.67 29.21,71.75 28.57,72.39 26.04,72.39 24.13,74.3 J4.8 | v36.83,5.71 36.83,4.45 38.73,2.54 TP13.TP | v32.38,6.99 31.11,6.99 29.84,8.26 26.04,8.26 25.4,7.62 v23.5,7.62 | v19.05,11.43 18.41,12.06 18.41,35.56 19.05,36.2 19.05,62.87 v19.68,63.5
  Bottom 0.152: v20.95,69.22 v19.68,67.94 | v23.5,71.75 23.5,73.66 J4.8 | v63.5,26.67 v64.77,25.4 | v60.33,32.38 v62.87,32.38 | v45.72,64.14 45.72,65.41 v46.35,66.04 | v36.83,5.71 34.92,7.62 33.02,7.62 v32.38,6.99 | v23.5,7.62 19.68,11.43 v19.05,11.43 | v18.41,64.77 v19.68,63.5
C2_TX  (via drill 0.35)
  Top 0.152: v51.44,12.06 51.44,17.78 | 51.44,17.78 51.44,19.05 50.8,19.68 U3.12 | v53.98,9.53 54.61,8.89 54.61,6.35 53.98,5.71 45.72,5.71 45.72,7.62 v43.18,7.62 | v40.64,6.35 38.73,6.35 TP12.TP | J4.6 28.57,74.3 28.57,78.74 7.62,78.74 1.27,72.39 1.27,28.57 6.35,28.57 X2.19 6.99,27.94 7.62,27.3 7.62,17.14 v13.34,17.14 | v50.16,17.78 51.44,17.78 | v30.48,16.51 v47.62,16.51 | v19.05,17.14 v24.13,17.14
  Bottom 0.152: v53.98,9.53 v51.44,12.06 | v43.18,7.62 41.91,7.62 v40.64,6.35 | v50.16,17.78 49.53,17.14 48.26,17.14 v47.62,16.51 | v30.48,16.51 29.84,17.14 v24.13,17.14 | v13.34,17.14 v19.05,17.14
CANH  (via drill 0.35)
  Top 0.152: IC1.7 13.97,62.87 10.79,59.69 R3.2 10.16,59.69 v8.89,60.96 | v5.71,74.93 5.08,74.3 5.08,64.14 | 5.08,64.14 3.81,62.87 J5.2 | 5.08,64.14 v6.99,62.23
  Bottom 0.152: v5.71,74.93 6.99,74.93 JP12.2 | v8.89,60.96 7.62,62.23 v6.99,62.23
CANL  (via drill 0.35)
  Top 0.152: IC1.6 13.97,65.41 10.79,65.41 10.79,66.67 R3.1 10.16,67.31 10.16,66.67 v8.89,65.41 8.26,64.77 8.26,57.78 3.81,57.78 J5.3
  Bottom 0.152: v8.89,65.41 7.62,65.41 JP10.2
CANRX  (via drill 0.35)
  Top 0.152: v28.57,67.31 28.57,68.58 26.67,68.58 26.04,67.94 22.23,67.94 IC1.4 | v31.11,64.77 28.57,62.23 28.57,61.59 MCU1.CANRX
  Bottom 0.152: v31.11,64.77 v28.57,67.31
CANTX  (via drill 0.35)
  Top 0.152: v24.13,59.05 23.5,59.69 22.23,59.69 IC1.1
  Bottom 0.152: v24.13,59.05 26.04,60.96 MCU1.CANTX
CARD_DETECT  (via drill 0.35)
  Top 0.152: v78.11,27.3 78.11,24.77 R1.2 | v26.67,33.66 29.21,33.66 v29.21,32.38 | v35.56,31.11 v30.48,31.11 | v40.01,32.38 41.91,32.38 41.91,33.02 42.55,33.66 v46.99,33.66 | v50.16,31.75 50.8,31.11 50.8,30.48 51.44,29.84 v60.96,29.84 | v66.04,31.11 68.58,33.66 v69.85,33.66 | v72.39,34.29 71.75,33.66 71.75,32.38 73.66,30.48 77.47,30.48 J1.8
  Bottom 0.152: v78.11,27.3 78.11,30.48 J1.8 | v26.67,33.66 23.5,33.66 MCU1.36 | v30.48,31.11 v29.21,32.38 | v35.56,31.11 36.83,32.38 v40.01,32.38 | v46.99,33.66 48.26,32.38 48.26,31.75 v50.16,31.75 | v60.96,29.84 62.23,31.11 v66.04,31.11 | v69.85,33.66 71.75,33.66 v72.39,34.29
CLICK  (via drill 0.35)
  Top 0.152: v84,67.5 84,68 86,70 S1.2 | v85.5,59 v85.5,63 | v85.5,55.5 85,55 v85,48 | v90,39.5 v90,43 | v81,33 v86,33 | v75.5,24 72,24 72,23.5 v70.5,22 | v64.5,21 63.5,20 U3.17
  Bottom 0.152: v84,67.5 84,64.5 v85.5,63 | v85.5,55.5 v85.5,59 | v90,43 v85,48 | v90,39.5 90,35.5 87.5,33 v86,33 | v81,33 79,31 79,27 77.5,25.5 77,25.5 v75.5,24 | v70.5,22 69.5,21 v64.5,21
CLICK_LL  (via drill 0.35)
  Top 0.152: v5,27.5 5,24 6,23 X2.21 | v5,30 4.5,30.5 4.5,53 9,57.5 v9,59.5 | v10.5,61 13,63.5 16.5,63.5 16.5,65.5 17.5,66.5 v17.5,67.5 | v19,72.5 22,72.5 22,71 J4.4 | v80.5,70.5 81,71 81,72.5 86,72.5 S1.3 | v77.5,70.5 73.5,70.5 73.5,69.5 72.5,68.5 72,68.5 71,69.5 v71,70.5 | v68,73.5 67,74.5 64.5,74.5 62,72 46,72 43,69 v30,69 | v28.5,69.5 25.5,69.5 v25.5,69
  Bottom 0.152: v5,30 v5,27.5 | v10.5,61 v9,59.5 | v17.5,67.5 17.5,71.5 18.5,72.5 v19,72.5 | v77.5,70.5 v80.5,70.5 | v68,73.5 v71,70.5 | v30,69 29.5,69.5 v28.5,69.5 | v25.5,69 25,69.5 23.5,69.5 22.5,70.5 J4.4
CS_C5_FRONT  (via drill 0.35)
  Top 0.152: v24.13,32.38 22.23,32.38 21.59,33.02 20.95,33.02 MCU1.37 | v36.2,36.83 36.83,36.2 v42.55,36.2 | v50.16,30.48 51.44,29.21 61.59,29.21 61.59,26.67 v60.96,26.04 | v66.67,22.23 67.31,21.59 67.31,19.05 v69.22,17.14 | v69.85,9.53 66.04,9.53 66.04,6.99 U3.8
  Bottom 0.152: v24.13,32.38 24.77,33.02 32.38,33.02 v36.2,36.83 | v42.55,36.2 45.09,33.66 45.72,33.66 48.9,30.48 v50.16,30.48 | v60.96,26.04 60.96,23.5 62.23,22.23 v66.67,22.23 | v69.22,17.14 70.48,15.88 72.39,15.88 73.66,14.61 73.66,10.16 73.03,9.53 v69.85,9.53
CS_C5_FRONT_5V  (via drill 0.35)
  Top 0.152: v52.5,58 55,55.5 v55,53.5 | v52.5,51 55.5,48 v55.5,47 | v63,40 63.5,39.5 v63.5,29.5 | v69.5,24.5 68.5,24.5 67,23 66,23 66,20 U3.18
  Bottom 0.152: v52.5,58 52.5,63.5 49,67 48,67 X3.6 | v52.5,51 v55,53.5 | v55.5,47 55.5,43 58.5,40 v63,40 | v63.5,29.5 66.5,26.5 67.5,26.5 v69.5,24.5
CS_C5_REAR  (via drill 0.35)
  Top 0.152: v30.48,35.56 v27.94,35.56 | v31.75,34.92 34.92,31.75 36.83,31.75 v36.83,31.11 | v38.1,30.48 40.01,28.57 v40.01,26.04 | v41.27,20.32 41.27,18.41 41.91,17.78 46.35,17.78 46.99,17.14 48.9,17.14 v48.9,16.51 | v60.96,15.24 v52.7,15.24 | v62.23,15.88 71.75,15.88 v76.2,20.32 | v81.92,20.95 95.89,20.95 v95.89,15.24 | v95.25,10.79 87.63,3.17 81.92,3.17 81.92,7.62 81.28,8.26 73.03,8.26 73.03,5.71 72.39,5.08 v69.85,5.08
  Bottom 0.152: v27.94,35.56 23.5,35.56 MCU1.38 | v30.48,35.56 31.11,34.92 v31.75,34.92 | v36.83,31.11 37.47,31.11 v38.1,30.48 | v40.01,26.04 40.01,25.4 39.37,24.77 39.37,22.23 v41.27,20.32 | v48.9,16.51 49.53,15.88 52.07,15.88 v52.7,15.24 | v60.96,15.24 61.59,15.88 v62.23,15.88 | v76.2,20.32 76.83,19.68 80.64,19.68 v81.92,20.95 | v95.89,15.24 96.52,14.61 96.52,12.06 v95.25,10.79 | v69.85,5.08 68.58,6.35 U3.9
CS_C5_REAR_5V  (via drill 0.35)
  Top 0.152: v67.94,71.12 66.67,71.12 66.04,70.48 66.04,67.31 X4.6 | v69.22,71.12 76.83,71.12 v76.83,71.75 | v78.11,74.3 78.11,74.93 79.38,76.2 94.61,76.2 94.61,66.67 95.89,66.67 95.89,67.31 v96.52,67.94 | v97.79,66.67 98.42,66.04 98.42,59.69 v95.89,57.15 | v93.98,55.24 94.61,54.61 94.61,38.1 90.81,34.29 v87.63,34.29 | v86.36,34.29 78.74,34.29 78.74,33.66 v76.2,31.11 | v71.12,23.5 68.58,23.5 68.58,20.32 U3.19
  Bottom 0.152: v69.22,71.12 v67.94,71.12 | v76.83,71.75 76.83,72.39 78.11,73.66 v78.11,74.3 | v97.79,66.67 v96.52,67.94 | v93.98,55.24 v95.89,57.15 | v86.36,34.29 v87.63,34.29 | v76.2,31.11 76.2,28.57 v71.12,23.5
CS_GYRO  (via drill 0.35)
  Top 0.152: v35.56,28.57 27.94,28.57 27.94,29.21 27.3,29.84 27.3,30.48 26.04,30.48 26.04,22.86 v26.67,22.23 | v24.13,19.68 21.59,19.68 21.59,19.05 20.95,18.41 MCU1.25
  Bottom 0.152: v35.56,28.57 36.2,29.21 JP6.2 | v24.13,19.68 v26.67,22.23
CS_MOUSE  (via drill 0.35)
  Top 0.152: v24.13,24.77 19.68,24.77 19.05,25.4 19.05,29.84 21.59,29.84 22.86,28.57 MCU1.32 | v26.67,24.13 28.57,22.23 31.75,22.23 33.66,20.32 40.01,20.32 40.01,20.95 40.64,21.59 46.99,21.59 46.99,22.86 48.26,24.13 J2.4
  Bottom 0.152: v24.13,24.77 24.77,24.13 v26.67,24.13
CS_SD  (via drill 0.35)
  Top 0.152: v19.05,30.48 20.32,30.48 MCU1.35 | v11.43,34.29 10.79,34.92 10.79,40.01 v17.14,46.35 | v19.68,47.62 24.77,47.62 24.77,43.18 v24.13,42.55 | v26.67,45.09 27.94,46.35 27.94,55.24 29.21,56.52 v33.66,56.52 | v36.2,59.05 42.55,59.05 v42.55,59.69 | v49.53,59.05 64.14,59.05 v64.14,57.15 | v71.75,50.8 73.03,49.53 v73.03,47.62 | v76.2,45.72 79.38,45.72 79.38,44.45 80.64,44.45 80.64,40.01 v80.01,39.37 | v80.01,33.66 80.01,31.11 J1.7
  Bottom 0.152: v19.05,30.48 15.24,30.48 v11.43,34.29 | v17.14,46.35 18.41,47.62 v19.68,47.62 | v26.67,45.09 v24.13,42.55 | v36.2,59.05 v33.66,56.52 | v42.55,59.69 43.18,59.05 46.99,59.05 47.62,58.42 48.9,58.42 v49.53,59.05 | v64.14,57.15 70.48,50.8 v71.75,50.8 | v73.03,47.62 73.66,46.99 74.93,46.99 v76.2,45.72 | v80.01,33.66 v80.01,39.37
DRDY_C  (via drill 0.35)
  Top 0.152: v19.05,20.95 19.05,19.68 20.95,19.68 21.59,20.32 22.86,20.32 MCU1.26 | v17.78,22.23 17.14,22.86 v17.14,33.66 | v24.13,40.01 v19.68,40.01 | v26.67,42.55 27.94,43.81 27.94,45.72 29.21,46.99 U2.4
  Bottom 0.152: v17.78,22.23 v19.05,20.95 | v17.14,33.66 17.14,36.2 19.05,38.1 19.05,39.37 v19.68,40.01 | v26.67,42.55 v24.13,40.01
DRDY_G  (via drill 0.35)
  Top 0.152: v24.13,22.23 24.77,21.59 24.77,18.41 23.5,18.41 MCU1.24 | v28.57,24.77 27.3,26.04 27.3,27.94 v26.67,28.57 | v28.57,30.48 31.11,33.02 v31.11,37.47 | v32.38,38.73 39.37,45.72 v42.55,45.72 | v46.99,46.99 v43.81,46.99 | v50.16,49.53 55.24,44.45 59.05,44.45 J3.5
  Bottom 0.152: v24.13,22.23 25.4,23.5 27.3,23.5 v28.57,24.77 | v28.57,30.48 v26.67,28.57 | v32.38,38.73 v31.11,37.47 | v43.81,46.99 v42.55,45.72 | v46.99,46.99 49.53,49.53 v50.16,49.53
EN  (via drill 0.35)
  Top 0.152: v19.68,27.3 19.68,26.67 20.32,26.04 MCU1.31 | v11.43,33.02 10.16,34.29 10.16,48.9 11.43,50.16 11.43,59.05 13.34,60.96 17.14,60.96 17.14,64.77 v19.05,66.67 | v25.4,63.5 29.21,63.5 29.21,64.14 30.48,65.41 42.55,65.41 42.55,64.14 v43.18,63.5 | v46.99,62.23 48.26,63.5 68.58,63.5 v68.58,60.96 | v72.39,55.88 74.3,53.98 v76.2,53.98 | v85.72,43.81 92.08,43.81 v92.08,43.18
  Bottom 0.152: v19.68,27.3 17.78,29.21 15.24,29.21 v11.43,33.02 | v19.05,66.67 19.68,66.04 22.86,66.04 v25.4,63.5 | v43.18,63.5 45.72,63.5 v46.99,62.23 | v68.58,60.96 71.12,58.42 71.12,57.15 v72.39,55.88 | v76.2,53.98 85.72,44.45 v85.72,43.81 | v92.08,43.18 95.25,40.01 97.16,40.01 U1.8
FIX  (via drill 0.35)
  Top 0.152: v30.48,29.84 33.66,29.84 v33.66,30.48 | v38.73,33.66 41.91,33.66 v47.62,39.37 | v54.61,46.35 57.78,46.35 57.78,45.72 58.42,45.09 v60.33,45.09 | v70.48,46.35 73.03,46.35 73.03,45.72 v73.66,45.09 | v78.74,45.09 v74.93,45.09 | v90.17,45.09 v83.82,45.09
  Bottom 0.152: v30.48,29.84 28.57,27.94 28.57,27.3 27.3,26.04 23.5,26.04 MCU1.30 | v33.66,30.48 36.2,33.02 38.1,33.02 v38.73,33.66 | v54.61,46.35 v47.62,39.37 | v60.33,45.09 62.87,47.62 69.22,47.62 v70.48,46.35 | v74.93,45.09 v73.66,45.09 | v78.74,45.09 79.38,45.72 83.19,45.72 v83.82,45.09 | v90.17,45.09 91.44,43.81 96.52,43.81 97.16,44.45 U1.6
GND  (via drill 0.35)
  Top 0.508: v56,36.1 56,32.5 56.3,32.2 v56.3,31.6 | v88.8,37.4 v91.2,37.4
  pour Bottom (isolate 0.406): 0,80 100,80 100,0 0,0 0,1.1
GPS_RX  (via drill 0.35)
  Top 0.152: v50.8,13.34 50.8,15.24 50.16,15.88 v45.09,15.88 29.21,15.88 v29.21,13.34 | v29.21,10.79 30.48,9.53 30.48,8.26 31.11,7.62 33.66,7.62 33.66,6.35 TP10.TP | v96.52,48.26 96.52,48.9 97.16,49.53 U1.4 | v93.34,45.09 92.71,44.45 92.71,40.01 91.44,38.73 87,38.73 v87,39.37 | v83.19,38.73 81.28,36.83 78.11,36.83 78.11,35.56 76.83,34.29 73.03,34.29 73.03,34.92 v72.39,35.56 | v58.42,28.57 50.8,28.57 v50.8,26.04
  Bottom 0.152: v50.8,13.34 48.9,13.34 MCU1.TX3 | v29.21,10.79 v29.21,13.34 | v93.34,45.09 v96.52,48.26 | v87,39.37 86.36,38.73 v83.19,38.73 | v72.39,35.56 71.12,34.29 66.04,34.29 63.5,31.75 61.59,31.75 v58.42,28.57 | v50.8,26.04 49.53,24.77 49.53,23.5 45.09,19.05 v45.09,15.88
GPS_TX  (via drill 0.35)
  Top 0.152: v45.72,10.79 45.72,12.7 MCU1.RX3 | v44.45,10.79 43.18,9.53 36.83,9.53 v36.83,10.16 | v36.83,7.62 36.2,6.99 36.2,3.81 34.92,2.54 TP11.TP | v96.52,45.72 96.52,46.35 97.16,46.99 U1.5 | v92.08,44.45 82.55,44.45 v82.55,45.09 | v80.01,45.09 80.64,45.72 80.64,46.99 74.3,46.99 v73.66,46.35 | v64.77,42.55 62.23,42.55 62.23,38.73 v62.87,38.1
  Bottom 0.152: v44.45,10.79 v45.72,10.79 | v36.83,7.62 v36.83,10.16 | v96.52,45.72 95.25,44.45 v92.08,44.45 | v80.01,45.09 v82.55,45.09 | v73.66,46.35 72.39,45.09 71.12,45.09 68.58,42.55 v64.77,42.55 | v62.87,38.1 59.69,34.92 57.15,34.92 46.99,24.77 46.99,21.59 44.45,19.05 44.45,14.61 45.72,13.34 MCU1.RX3
I1  (via drill 0.35)
  Top 0.152: v19.05,22.23 20.32,20.95 MCU1.27 | v17.78,34.92 v17.78,23.5 | v24.13,37.47 v19.68,37.47 | v26.67,40.01 27.94,41.27 27.94,43.18 29.21,44.45 U2.5
  Bottom 0.152: v17.78,23.5 v19.05,22.23 | v17.78,34.92 19.68,36.83 v19.68,37.47 | v26.67,40.01 v24.13,37.47
I2  (via drill 0.35)
  Top 0.152: v24.13,34.92 24.77,34.29 24.77,23.5 23.5,23.5 MCU1.28 | v26.67,34.92 27.3,35.56 27.3,40.01 29.21,41.91 U2.6
  Bottom 0.152: v26.67,34.92 v24.13,34.92
INT1  (via drill 0.35)
  Top 0.152: v15.88,31.11 15.88,10.79 19.68,10.79 19.68,12.06 19.05,12.7 19.05,13.97 20.32,15.24 MCU1.23 | v11.43,35.56 11.43,38.73 13.97,41.27 17.14,41.27 v17.14,42.55 | v24.13,45.09 v19.68,45.09 | v26.67,47.62 27.3,48.26 27.3,55.24 29.21,57.15 34.29,57.15 34.29,53.98 v34.92,53.34 | v36.2,54.61 41.27,54.61 43.81,52.07 v46.35,52.07 | v48.26,52.07 53.34,52.07 59.05,46.35 J3.4
  Bottom 0.152: v11.43,35.56 v15.88,31.11 | v19.68,45.09 v17.14,42.55 | v26.67,47.62 v24.13,45.09 | v36.2,54.61 v34.92,53.34 | v48.26,52.07 v46.35,52.07
LED  (via drill 0.35)
  Top 0.152: v24.13,29.84 23.5,30.48 MCU1.34 | v26.67,29.84 27.3,29.21 27.3,28.57 27.94,27.94 33.02,27.94 33.02,24.77 J2.10
  Bottom 0.152: v26.67,29.84 v24.13,29.84
MISO  (via drill 0.35)
  Top 0.152: v36.2,35.56 38.1,33.66 38.1,33.02 44.45,26.67 | 44.45,26.67 45.72,25.4 45.72,24.77 J2.5 | v50.16,34.92 52.07,34.92 53.34,33.66 MCU1.MISO_ICSP | 44.45,26.67 46.99,29.21 46.99,31.75 v48.9,33.66 49.53,33.02 49.53,23.5 46.99,20.95 | v55.24,9.53 57.78,6.99 U3.5 | 52.07,17.78 52.07,20.32 50.8,21.59 49.53,20.32 49.53,19.05 48.9,18.41 47.62,18.41 46.35,19.68 46.35,20.32 46.99,20.95 | 52.07,17.78 v52.07,13.34 | v75.56,29.84 75.56,29.21 83.82,29.21 85.09,30.48 J1.5 | v73.03,27.3 71.12,25.4 67.94,25.4 67.94,24.77 64.77,24.77 64.77,22.86 62.23,20.32 62.23,19.05 61.59,18.41 61.59,17.78 52.07,17.78 | v26.67,7.62 26.67,6.35 24.77,6.35 TP6.TP | v26.67,10.79 v26.67,8.89 | v27.94,14.61 27.94,17.14 31.11,20.32 33.02,20.32 33.66,19.68 40.64,19.68 40.64,20.95 46.99,20.95
  Bottom 0.152: v36.2,35.56 36.2,34.92 JP1.2 | v48.9,33.66 v50.16,34.92 | v55.24,9.53 53.98,10.79 53.34,10.79 52.07,12.06 v52.07,13.34 | v73.03,27.3 v75.56,29.84 | v26.67,8.89 v26.67,7.62 | v26.67,10.79 26.67,12.06 27.3,12.7 27.3,13.97 v27.94,14.61
MISO+  (via drill 0.35)
  Top 0.152: v75.56,49.53 76.2,48.9 IC2.6 | v70.48,52.07 62.87,52.07 v62.87,51.44 | v60.33,52.7 53.98,52.7 53.98,53.34 v48.26,59.05 | v45.72,59.69 45.09,60.33 45.09,62.87 v43.18,64.77 | v43.18,67.31 44.45,68.58 44.45,69.22 46.35,71.12 48.9,71.12 48.9,69.85 X3.5
  Bottom 0.152: v75.56,49.53 73.66,51.44 71.12,51.44 v70.48,52.07 | v62.87,51.44 62.23,52.07 60.96,52.07 v60.33,52.7 | v48.26,59.05 47.62,59.69 v45.72,59.69 | v43.18,67.31 v43.18,64.77
MISO+R  (via drill 0.35)
  Top 0.152: v81.92,58.42 82.55,57.78 82.55,46.99 87,46.99 88.27,48.26 IC3.6 | v80.01,56.52 75.56,56.52 75.56,57.15 73.66,57.15 v73.66,55.88 | v67.31,66.04 67.31,69.22 X4.5
  Bottom 0.152: v80.01,56.52 v81.92,58.42 | v73.66,55.88 71.75,53.98 71.12,53.98 69.85,55.24 70.48,55.88 70.48,58.42 68.58,60.33 67.94,60.33 67.94,65.41 v67.31,66.04
MISO-  (via drill 0.35)
  Top 0.152: v78.74,52.7 78.74,48.9 IC2.5 | v74.93,56.52 v77.47,53.98 | v69.22,66.04 67.94,66.04 67.94,65.41 55.88,65.41 55.88,66.67 53.34,69.22 52.7,69.22 50.8,67.31 X3.4
  Bottom 0.152: v77.47,53.98 v78.74,52.7 | v74.93,56.52 72.39,59.05 71.12,59.05 69.22,60.96 v69.22,66.04
MISO-R  (via drill 0.35)
  Top 0.152: v87.5,56.5 91,56.5 92.5,55 92.5,50 91.5,49 IC3.5 | v86.5,57.5 83,57.5 83,58.5 82,59.5 81,59.5 v81,59 | v78,58.5 72.5,58.5 72.5,64 v71.5,65
  Bottom 0.152: v86.5,57.5 v87.5,56.5 | v81,59 80,60 78.5,58.5 v78,58.5 | v71.5,65 69.5,67 68.5,67 X4.4
MISO_5V  (via drill 0.35)
  Top 0.152: v66.04,41.27 66.04,44.45 67.31,45.72 S2.5 | v64.77,40.01 64.77,29.21 v63.5,27.94 | v60.96,27.94 52.07,27.94 52.07,23.5 52.7,22.86 57.15,22.86 v57.15,23.5
  Bottom 0.152: v64.77,40.01 v66.04,41.27 | v60.96,27.94 v63.5,27.94 | v57.15,23.5 57.15,20.95 57.78,20.32 U3.15
MOSI  (via drill 0.35)
  Top 0.152: v48.26,42.55 49.53,41.27 49.53,36.2 50.8,36.2 MCU1.MOSI_ICSP 51.44,35.56 52.07,35.56 52.73,34.9 54.9,34.9 54.9,36.5 55.6,37.2 56.8,37.2 57.1,37.02 57.08,36.45 57.15,32.38 57.78,31.75 60.96,31.75 60.96,53.34 62.23,54.61 69.85,54.61 69.85,55.24 72.39,57.78 v78.74,57.78 | v46.99,41.27 46.35,41.91 v38.1,41.91 38.1,39.37 36.2,37.47 35.56,37.47 35.56,34.92 43.18,27.3 43.18,24.77 J2.6 43.18,24.13 43.18,22.86 40.01,22.86 39.37,23.5 39.37,26.04 38.1,26.04 36.83,24.77 36.83,21.59 v36.2,20.95 | v27.94,10.79 27.94,11.43 26.04,11.43 26.04,10.79 24.77,9.53 TP5.TP | v96.52,33.02 98.42,31.11 98.42,27.94 96.52,26.04 96.52,10.16 95.25,10.16 89.53,4.45 89.53,2.54 81.92,2.54 81.28,3.17 81.28,6.35 75.56,6.35 73.66,4.45 59.05,4.45 57.15,6.35 55.88,6.35 U3.4 | 87,32.38 83.19,32.38 83.19,31.11 J1.6 | 87,32.38 v94.61,32.38 | v80.01,59.05 81.92,57.15 81.92,43.81 82.55,43.18 84.45,43.18 84.45,42.55 85.09,41.91 85.09,38.73 87.63,36.2 87.63,35.56 87,34.92 87,32.38
  Bottom 0.152: v38.1,41.91 37.47,42.55 JP9.1 | v46.99,41.27 v48.26,42.55 | v27.94,10.79 27.94,11.43 28.57,12.06 28.57,13.97 29.21,13.97 v36.2,20.95 | v96.52,33.02 95.89,32.38 v94.61,32.38 | v80.01,59.05 v78.74,57.78
MOSI+  (via drill 0.35)
  Top 0.152: IC2.8 71.12,48.9 71.12,54.61 R7.2 71.75,55.24 71.75,56.52 72.39,57.15 v73.03,57.15 | v55.24,66.04 55.24,66.67 53.34,68.58 52.7,68.58 51.44,67.31 51.44,65.41 48.26,65.41 46.99,66.67 45.72,66.67 X3.8 | v53.98,64.77 54.61,64.14 69.85,64.14 69.85,60.33 v71.75,58.42
  Bottom 0.152: v53.98,64.77 v55.24,66.04 | v73.03,57.15 v71.75,58.42
MOSI+R  (via drill 0.35)
  Top 0.152: IC3.8 84,49 84,54.5 R8.2 84,55 84,56.5 86.5,56.5 90.5,60.5 90.5,61 v92,62.5 | v88.5,66 88.5,74 85,74 84,73 68.5,73 68,72.5 67.5,72.5 65.5,70.5 65.5,68.5 64.5,67.5 63.5,67.5 X4.8
  Bottom 0.152: v92,62.5 v88.5,66
MOSI-  (via drill 0.35)
  Top 0.152: R7.1 78.74,54.61 78.74,53.98 74.93,50.16 74.93,49.53 74.3,48.9 IC2.7 73.66,48.26 73.66,46.99 71.12,46.99 70.48,47.62 70.48,51.44 66.04,51.44 64.77,50.16 v62.87,50.16 | v48.9,66.04 48.9,67.94 48.26,68.58 48.26,69.22 46.99,69.22 X3.7 | v46.99,63.5 46.35,62.87 46.35,60.96 47.62,59.69 47.62,58.42 55.88,50.16 v60.33,50.16
  Bottom 0.152: v48.9,66.04 46.99,64.14 v46.99,63.5 | v62.87,50.16 v60.33,50.16
MOSI-R  (via drill 0.35)
  Top 0.152: 89.98,52.52 90.81,53.34 90.81,54.61 R8.1 | 89.98,52.52 86.36,48.9 IC3.7 | v67,73 65,71 65,70 X4.7 | v68.5,72 76,72 76.5,72.5 78.5,72.5 v78.5,68.5 | v83,63 83,60 85,58 86,58 86.5,58.5 v87.5,58.5 | v88.5,57.5 93,57.5 93,48 92,47 90,47 90,52.5 89.98,52.52
  Bottom 0.152: v67,73 68,72 v68.5,72 | v78.5,68.5 83,64 v83,63 | v88.5,57.5 v87.5,58.5
MOSI_5V  (via drill 0.35)
  Top 0.152: v64.14,45.09 64.14,45.72 S2.2 | v65.41,28.57 v65.41,43.81 | v66.67,27.3 66.04,26.67 v66.04,25.4 | v65.41,24.13 65.41,20.95 64.77,20.32 64.77,19.05 63.5,17.78 v62.23,17.78 | v60.96,18.41 55.88,18.41 55.88,19.68 U3.14
  Bottom 0.152: v65.41,43.81 v64.14,45.09 | v66.67,27.3 v65.41,28.57 | v66.04,25.4 66.04,24.77 v65.41,24.13 | v62.23,17.78 61.59,18.41 v60.96,18.41
N$1
  Top 0.152: C2.1 80.01,74.93 83.82,74.93 84.45,75.56 92.71,75.56 92.71,74.3 X1.2 93.34,73.66 93.34,67.31 X1.3
N$2  (via drill 0.35)
  Top 0.152: S2.1 64.14,43.81 66.04,45.72 66.04,47.62 66.67,48.26 S2.6 66.67,48.9 v66.04,49.53 | v83.19,43.81 84.45,43.81 85.72,42.55 85.72,41.27 IC3.2 | IC2.2 74.3,40.64 74.3,39.37 77.47,39.37 78.11,40.01 78.11,41.91 v80.01,43.81 71.75,43.81 69.85,45.72 69.85,50.8 v67.31,50.8
  Bottom 0.152: v80.01,43.81 v83.19,43.81 | v67.31,50.8 v66.04,49.53
N$3  (via drill 0.35)
  Top 0.152: 69.22,43.81 71.12,43.81 71.75,43.18 76.2,43.18 | 69.22,43.81 67.31,43.81 S2.4 | 76.2,43.18 76.2,41.27 IC2.3 | 69.22,43.81 69.22,50.16 65.41,50.16 64.14,48.9 S2.3 | v87,43.18 87,42.55 88.27,41.27 IC3.3 | 76.2,43.18 v78.11,43.18
  Bottom 0.152: v78.11,43.18 v87,43.18
N$4  (via drill 0.35)
  Top 0.152: v48.9,10.16 45.09,10.16 45.09,11.43 43.81,12.7 MCU1.TX2 | v50.16,8.89 51.44,10.16 52.7,10.16 52.7,6.99 U3.3
  Bottom 0.152: v50.16,8.89 v48.9,10.16
N$5  (via drill 0.35)
  Top 0.152: v50.16,11.43 50.16,15.24 43.18,15.24 41.27,13.34 MCU1.RX2 | v52.07,9.53 50.8,8.26 50.8,6.99 U3.2
  Bottom 0.152: v52.07,9.53 v50.16,11.43
N$7
  Top 0.152: 86,66.5 80.5,66.5 80,66 80,64.5 R4.2 | 86,66.5 86,67.5 S1.1 | 86,66.5 86,65 95,65 97.5,67.5 97.5,70.5 X1.1
N$8
  Top 0.254: JP3.1 36.83,50.16 31.11,50.16 31.11,50.8 29.84,52.07 U2.2
N$9
  Top 0.254: JP7.1 62.87,55.24 59.69,55.24 59.69,54.61 J3.1
N$10
  Top 0.254: JP4.1 71.12,28.57 95.25,28.57 95.25,30.48 J1.1
N$11  (via drill 0.35)
  Top 0.152: v8.89,71.12 11.43,68.58 24.77,68.58 24.77,70.48 J4.3
  Bottom 0.152: v8.89,71.12 7.62,71.12 | 7.62,71.12 7.62,74.3 JP12.1 | 7.62,71.12 JP11.3
N$12  (via drill 0.35)
  Top 0.152: v24.13,14.61 23.5,15.24 MCU1.22 | v26.67,16.51 26.67,17.78 v29.21,20.32 | v31.75,19.05 33.66,17.14 v45.72,17.14 | v53.98,8.26 53.34,8.89 53.34,10.16 62.87,10.16 62.87,6.99 U3.7
  Bottom 0.152: v24.13,14.61 26.04,16.51 v26.67,16.51 | v29.21,20.32 30.48,19.05 v31.75,19.05 | v45.72,17.14 47.62,15.24 50.16,15.24 51.44,13.97 51.44,12.7 50.8,12.7 50.8,11.43 51.44,11.43 53.34,9.53 53.34,8.89 v53.98,8.26
N$13
  Top 0.254: JP2.1 59.69,24.77 57.78,24.77 56.52,26.04 53.98,26.04 53.98,24.77 J2.2
N$14
  Top 0.254: JP5.1 94.61,61.59 94.61,57.15 97.16,54.61 U1.2
N$15  (via drill 0.35)
  Top 0.152: v7.62,67.31 8.26,67.94 8.26,71.75 9.53,71.75 9.53,71.12 11.43,69.22 19.05,69.22 19.05,70.48 J4.5
  Bottom 0.152: v7.62,67.31 7.62,66.04 JP10.3
N$16  (via drill 0.35)
  Top 0.152: v8.26,76.83 11.43,76.83 12.7,78.11 26.67,78.11 26.67,74.3 J4.7
  Bottom 0.152: v8.26,76.83 7.62,76.2 JP12.3
N$17
  Top 0.152: IC1.8 13.97,59.69 12.06,57.78 12.06,52.7 14.61,50.16 R2.1
N$18  (via drill 0.35)
  Top 0.152: v5.71,64.77 6.99,66.04 6.99,68.58 | 6.99,68.58 6.99,71.12 12.7,76.83 22.23,76.83 22.23,73.03 22.86,72.39 25.4,72.39 27.3,70.48 J4.2 | 6.99,68.58 v6.35,68.58
  Bottom 0.152: v5.71,64.77 6.99,64.77 JP10.1 | v6.35,68.58 6.99,69.22 JP11.1
N$19  (via drill 0.35)
  Top 0.152: v36.83,28.57 36.2,29.21 28.57,29.21 27.94,29.84 27.94,31.11 26.04,33.02 26.04,54.61 29.21,57.78 v30.48,57.78 | v31.75,59.05 33.02,59.05 33.02,58.42 41.27,58.42 41.27,55.24 43.18,53.34 v46.35,53.34 | v47.62,53.34 47.62,50.16 51.44,46.35 52.07,46.35 56.52,41.91 59.05,41.91 J3.6
  Bottom 0.152: v36.83,28.57 36.83,29.21 JP6.1 | v31.75,59.05 v30.48,57.78 | v47.62,53.34 v46.35,53.34
N$20  (via drill 0.35)
  Top 0.152: v37.47,35.56 43.18,35.56 43.18,38.73 v45.72,41.27 | v48.9,44.45 51.44,44.45 51.44,43.81 56.52,38.73 59.05,38.73 J3.7
  Bottom 0.152: v37.47,35.56 36.83,34.92 JP1.1 | v48.9,44.45 v45.72,41.27
N$21  (via drill 0.35)
  Top 0.152: v36.2,41.27 36.83,41.91 36.83,42.55 37.47,43.18 43.18,43.18 v43.18,44.45 | v47.62,48.9 50.8,45.72 52.07,45.72 57.15,40.64 v57.15,40.01 | v57.78,38.1 59.05,36.83 J3.8
  Bottom 0.152: v36.2,41.27 36.2,42.55 JP9.2 | v47.62,48.9 v43.18,44.45 | v57.15,40.01 57.15,38.73 v57.78,38.1
N$22  (via drill 0.35)
  Top 0.152: v37.47,36.83 41.91,41.27 v43.18,41.27 | v48.26,45.72 50.16,45.72 50.8,45.09 52.07,45.09 52.07,43.81 56.52,39.37 57.78,39.37 58.42,40.01 60.33,40.01 60.33,34.92 59.69,34.29 J3.9
  Bottom 0.152: v37.47,36.83 36.2,38.1 JP8.2 | v43.18,41.27 47.62,45.72 v48.26,45.72
NPD  (via drill 0.35)
  Top 0.152: v24.13,27.3 22.23,27.3 21.59,27.94 20.95,27.94 MCU1.33 | v26.67,26.67 26.67,25.4 28.57,23.5 28.57,22.86 32.38,22.86 32.38,22.23 35.56,22.23 35.56,24.13 J2.9
  Bottom 0.152: v24.13,27.3 24.77,26.67 v26.67,26.67
PPS  (via drill 0.35)
  Top 0.152: v19.05,23.5 20.32,23.5 MCU1.29 | v13.34,26.67 9.53,30.48 7.62,30.48 6.35,29.21 1.91,29.21 1.91,58.42 3.81,60.33 7.62,60.33 7.62,66.04 10.16,68.58 10.79,68.58 13.34,66.04 16.51,66.04 v16.51,67.94 | v16.51,69.85 17.78,71.12 17.78,72.39 v21.59,76.2 | v26.04,76.2 v22.86,76.2 | v29.21,76.2 40.64,76.2 40.64,74.93 43.18,72.39 v45.09,72.39 | v49.53,71.12 55.88,71.12 55.88,70.48 60.33,66.04 v64.77,66.04 | v77.47,77.47 78.74,78.74 95.25,78.74 v95.25,67.31
  Bottom 0.152: v19.05,23.5 15.88,26.67 v13.34,26.67 | v16.51,69.85 v16.51,67.94 | v22.86,76.2 v21.59,76.2 | v29.21,76.2 v26.04,76.2 | v45.09,72.39 46.35,71.12 v49.53,71.12 | v64.77,66.04 66.04,66.04 67.31,67.31 67.31,67.94 67.94,68.58 73.03,68.58 76.2,71.75 76.2,72.39 77.47,73.66 v77.47,77.47 | v95.25,67.31 98.42,64.14 98.42,58.42 97.79,57.78 U1.1
RPI_RX  (via drill 0.35)
  Top 0.152: v38.1,10.16 38.1,12.7 MCU1.TX1 | v40.64,7.62 41.27,6.99 41.27,3.81 42.55,2.54 TP15.TP 43.18,1.91 43.18,1.27 57.78,1.27 59.05,2.54 J6.2
  Bottom 0.152: v40.64,7.62 v38.1,10.16
RPI_TX  (via drill 0.35)
  Top 0.152: v32.38,10.16 33.02,10.16 35.56,12.7 MCU1.RX1 | v31.11,8.89 31.75,8.26 42.55,8.26 42.55,5.71 TP14.TP 43.18,5.08 44.45,3.81 44.45,3.17 56.52,3.17 J6.1
  Bottom 0.152: v31.11,8.89 v32.38,10.16
RST  (via drill 0.35)
  Top 0.152: v50.16,37.47 52.07,37.47 52.7,38.1 53.34,38.1 MCU1.RESET_ICSP | v48.9,32.38 47.62,31.11 47.62,25.4 46.99,24.77 46.99,23.5 45.72,22.23 38.73,22.23 38.73,24.13 J2.8
  Bottom 0.152: v50.16,37.47 48.26,35.56 48.26,33.02 v48.9,32.38
SCK  (via drill 0.35)
  Top 0.152: v72.39,10.16 72.39,5.71 62.87,5.71 62.23,6.35 60.96,6.35 U3.6 | v77.47,21.59 76.83,20.95 76.83,19.68 76.2,19.68 v71.75,15.24 61.59,15.24 61.59,15.88 52.7,15.88 v52.7,16.51 | v78.74,20.32 80.01,21.59 86.36,21.59 v86.36,26.67 | 37.47,32.38 40.64,29.21 40.64,24.77 J2.7 | 37.47,32.38 34.92,34.92 34.92,37.47 v37.47,40.01 37.47,42.55 v45.72,42.55 | v46.99,43.81 47.62,43.18 50.8,43.18 55.24,38.73 55.24,37.47 53.98,36.2 MCU1.SCK_ICSP | v27.3,6.35 27.3,5.08 24.77,2.54 TP7.TP | v26.67,13.34 27.3,13.97 27.3,17.14 v31.11,20.95 | v33.02,22.86 34.29,22.86 34.29,24.77 37.47,27.94 37.47,32.38 | v50.8,16.51 49.53,16.51 49.53,17.14 48.9,17.78 46.99,17.78 46.99,18.41 45.09,20.32 v44.45,20.32
  Bottom 0.152: v72.39,10.16 72.39,11.43 73.03,12.06 73.03,13.97 v71.75,15.24 | v78.74,20.32 v77.47,21.59 | v86.36,26.67 86.36,29.21 87.63,30.48 J1.4 | v37.47,40.01 37.47,38.73 JP8.1 | v45.72,42.55 v46.99,43.81 | v27.3,6.35 27.3,9.53 26.67,9.53 26.04,10.16 26.04,12.7 v26.67,13.34 | v33.02,22.86 v31.11,20.95 | v50.8,16.51 v52.7,16.51 | v44.45,20.32 40.64,24.13 J2.7
SCK_5V  (via drill 0.35)
  Top 0.152: v52.7,70.48 52.07,69.85 X3.3 | v56.52,71.12 62.87,71.12 v62.87,69.85 | v60.33,17.14 68.58,17.14 68.58,16.51 69.85,16.51 v69.85,22.86 | v67.31,25.4 68.58,26.67 v68.58,29.21 | v72.39,33.02 77.47,33.02 77.47,33.66 80.01,36.2 v84.45,36.2 | v87,38.1 93.98,38.1 93.98,53.98 93.34,54.61 93.34,59.69 92.71,60.33 92.71,63.5 87.63,63.5 v87.63,59.69 | v80.64,65.41 v85.09,65.41 | v78.11,65.41 72.39,65.41 72.39,67.31 69.85,69.85 X4.3
  Bottom 0.152: v52.7,70.48 53.34,71.12 v56.52,71.12 | v62.87,69.85 64.14,68.58 67.31,68.58 67.94,69.22 69.22,69.22 X4.3 | v60.33,17.14 60.33,19.68 U3.16 | v67.31,25.4 v69.85,22.86 | v68.58,29.21 68.58,31.11 70.48,33.02 v72.39,33.02 | v84.45,36.2 86.36,38.1 v87,38.1 | v87.63,59.69 87.63,62.87 v85.09,65.41 | v78.11,65.41 v80.64,65.41
SCL1  (via drill 0.35)
  Top 0.152: R6.2 91.44,4.45 97.79,10.79 97.79,12.7 MCU1.SCL1 97.79,13.34 97.16,13.97 v97.16,15.24 | U2.8 29.84,37.47 29.84,38.1 v34.29,38.1 34.29,33.66 v34.92,33.02 | v29.21,23.5 v29.21,27.3 | v29.21,21.59 26.04,18.41 26.04,12.7 27.94,12.7 v27.94,13.34 28.57,13.97 28.57,15.88 31.11,18.41 31.11,19.68 32.38,19.68 32.38,19.05 v40.64,19.05 | v27.94,7.62 27.94,3.81 29.21,2.54 TP9.TP | v85.72,16.51 v95.25,16.51 | v84.45,15.88 75.56,15.88 v75.56,15.24 | v53.98,16.51 v67.31,16.51 | v45.72,18.41 41.91,18.41 v41.91,19.05
  Bottom 0.152: v34.29,38.1 35.56,38.1 JP8.3 | v29.21,27.3 v34.92,33.02 | v29.21,21.59 v29.21,23.5 | v27.94,13.34 27.94,12.06 27.3,11.43 27.3,10.16 27.94,9.53 v27.94,7.62 | v97.16,15.24 95.89,16.51 v95.25,16.51 | v85.72,16.51 85.09,15.88 v84.45,15.88 | v75.56,15.24 73.03,17.78 68.58,17.78 v67.31,16.51 | v53.98,16.51 52.07,18.41 v45.72,18.41 | v40.64,19.05 v41.91,19.05
SDA1  (via drill 0.35)
  Top 0.152: U2.7 29.84,39.37 31.11,39.37 v34.29,42.55 v40.01,48.26 | R5.2 91.44,8.26 95.25,12.06 95.25,12.7 MCU1.SDA1 95.25,13.34 95.25,15.24 85.72,15.24 85.09,15.88 85.09,16.51 v80.64,20.95 | v46.35,49.53 v41.27,49.53 | v48.26,50.8 49.53,49.53 49.53,48.9 51.44,46.99 52.07,46.99 56.52,42.55 v60.33,42.55 | v62.87,41.27 64.14,40.01 v64.14,30.48 | v70.48,24.77 76.83,24.77 76.83,24.13 78.11,22.86 v78.74,22.86 | v45.09,6.99 45.09,5.71 46.99,3.81 73.66,3.81 75.56,5.71 80.64,5.71 80.64,3.17 81.92,1.91 93.34,1.91 v93.34,5.08
  Bottom 0.152: v34.29,42.55 35.56,42.55 JP9.3 | v41.27,49.53 v40.01,48.26 | v46.35,49.53 47.62,50.8 v48.26,50.8 | v60.33,42.55 61.59,41.27 v62.87,41.27 | v64.14,30.48 65.41,29.21 66.04,29.21 v70.48,24.77 | v80.64,20.95 v78.74,22.86 | v45.09,6.99 43.81,8.26 43.18,8.26 40.64,10.79 34.29,10.79 29.84,6.35 TP8.TP | v93.34,5.08 90.81,7.62 R5.2
VIN
  Top 0.254: 70.48,64.77 55.24,64.77 53.34,66.67 X3.2 52.7,66.67 52.7,64.77 46.35,64.77 45.72,65.41 43.81,65.41 43.18,66.04 20.95,66.04 18.41,63.5 18.41,36.83 14.61,33.02 14.61,6.35 TP1.TP | 70.48,64.77 70.48,66.67 X4.2 | 70.48,64.77 70.48,62.23 71.12,61.59 MCU1.VIN

### Text on the board
tPlace: 1 | High-Level v3.0 | TX | RX
bPlace: CAN SELECT | GYRO COM SELECT